# Altium project dev-board-24.PrjPcb (part 1 of 2)
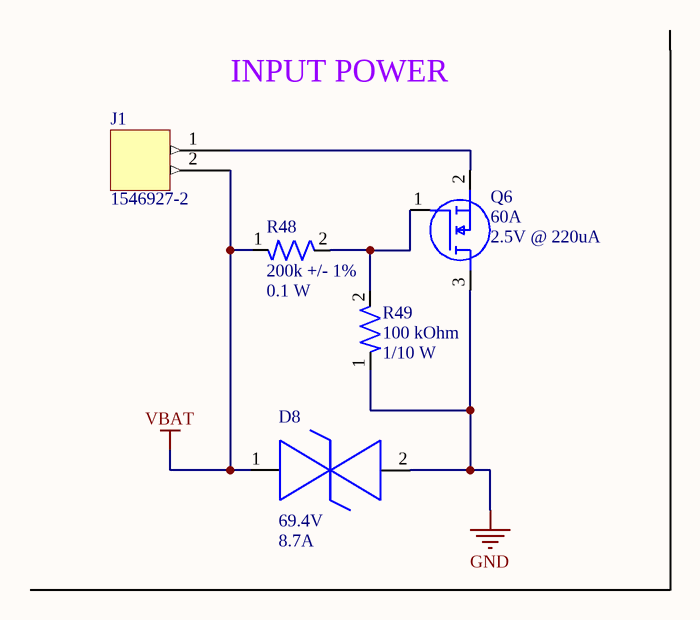
[diagram p0: Power-conn.SchDoc]
8 sheets, 260 parts. Net scope: flat (ports and power ports of the same name join across sheets).
Board file: dev-board.PcbDoc
Sheets:
  Power-conn.SchDoc
  24V-5A-buck.SchDoc
  12V-5A-buck.SchDoc
  12V-2A-buck.SchDoc
  5V-and-3V3-ldo.SchDoc
  3V3-buck.SchDoc
  5V-buck.SchDoc
  can-stm32g4.SchDoc

## Sheet Power-conn.SchDoc
size A; SheetNumber: 1; SheetTotal: 8

### Parts
D8  Vclamp: 69.4V  Peak pulser current: 8.7A  [DO-214AA (SMBJ)]  (hidden comment: SMBJE43CAH)
J1  1546927-2  [CONN-1546927-2]
Q6  Drain Current: 60A  Vgs: 2.5V @ 220uA  [NMOS-8PowerVDFN]  (hidden comment: TPH7R006PL,L1Q)
R48  Resistance: 200k +/- 1%  Power Rating: 0.1 W  [RES-0603]  (hidden comment: ERJ-3EKF2003V)
R49  Resistance: 100 kOhm  Power: 1/10 W  [RES-0603]  (hidden comment: RC0603FR-07100KL)

### Nets
GND: D8.2 Q6.3(D) R49.1
VBAT: D8.1 J1.2 R48.1
NetJ1_1: J1.1 Q6.2(S)
NetQ6_1: Q6.1(G) R48.2 R49.2

### Notes on the sheet
- INPUT POWER

### Library data of the parts
D8 = DIO-69.4V-0001: 69.4V Clamp 8.7A Ipp Tvs Diode Surface Mount DO-214AA (SMBJ); Channels: Bidirectional; Breakdown VOltage: 47.8V; Reverse working maximum voltage: 43V; Package: DO-214AA (SMBJ)
J1 = CON-2POS-0003
Q6 = NMOS-60A-0001: N-Channel 60 V 60A (Tc) 81W (Tc) Surface Mount 8-SOP Advance (5x5); Vdss: 60V; Vgs(Max): 20V; Package: 8-PowerVDFN
R48 = RES-200K-0001: 200 kOhms ±1% 0.1W, 1/10W Chip Resistor 0603 (1608 Metric) Automotive AEC-Q200 Thick Film; Manufacturer: Panasonic Electronic Components; Assembled?: Yes; MFP: ERJ-3EKF2003V; Package SIze: 0603
R49 = RES-100K-0003: 100 kOhms ±1% 0.1W, 1/10W Chip Resistor 0603 (1608 Metric) Moisture Resistant Thick Film; Tolerance: +/- 1%; Assembled?: No; Package Size: 0603

## Sheet 24V-5A-buck.SchDoc
size A4; SheetNumber: 2; SheetTotal: 8
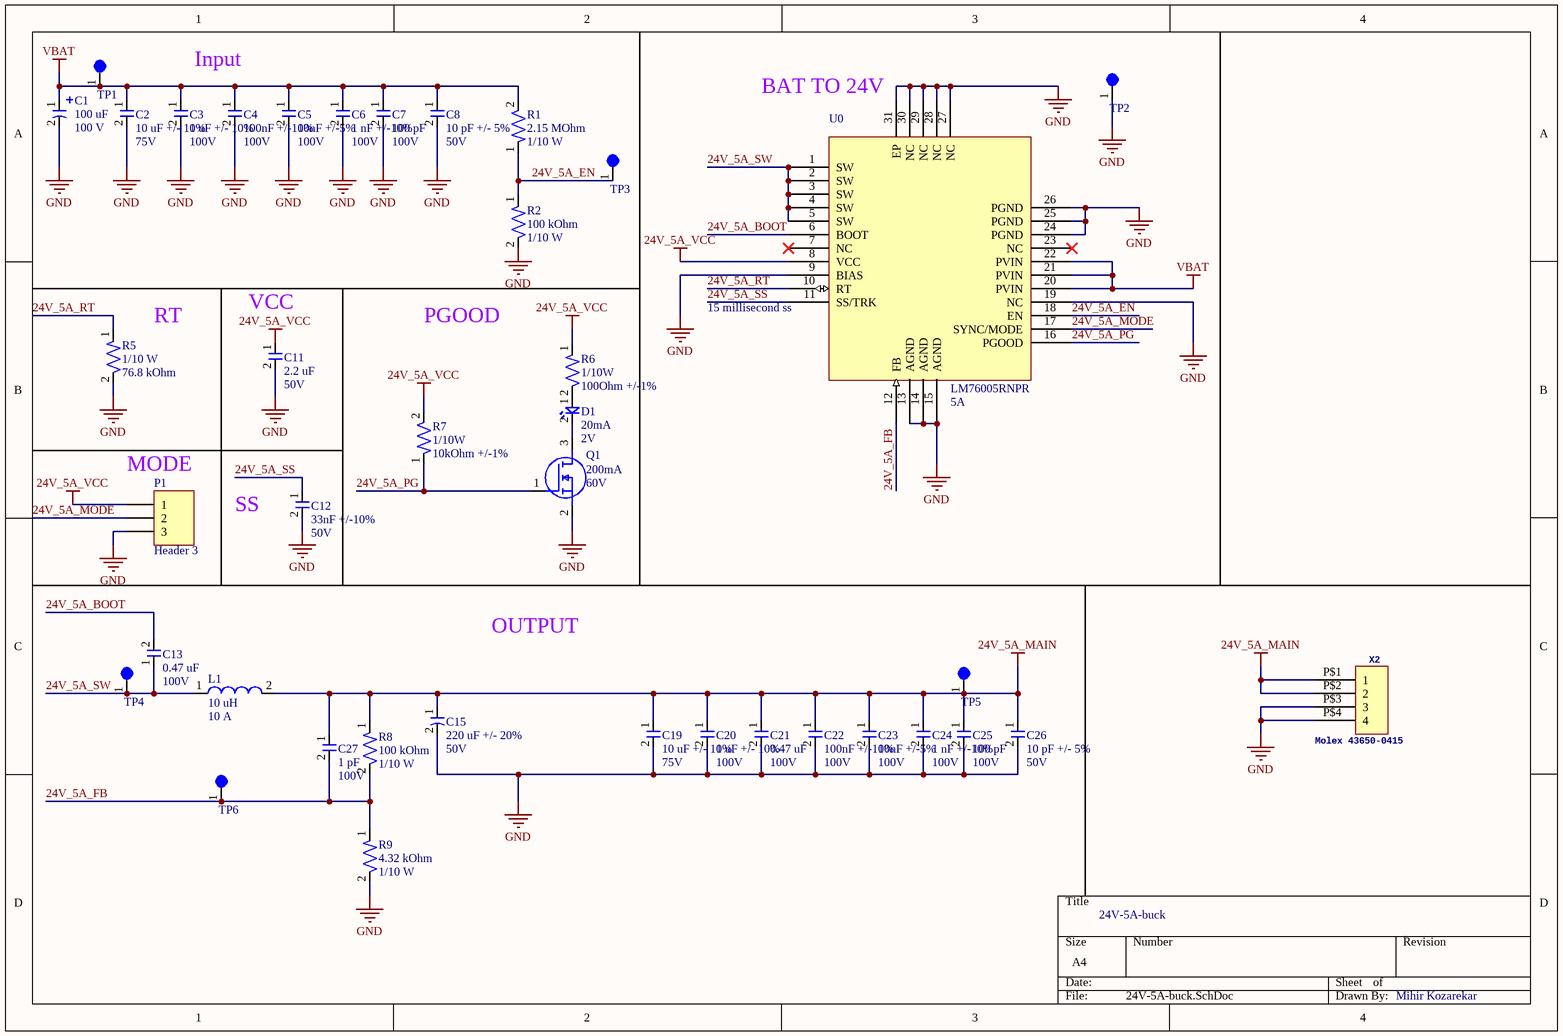
[diagram p1: 24V-5A-buck.SchDoc]

### Parts
C1  Capacitance: 100 uF  Voltage: 100 V  [ELEC-100U-0001]  (hidden comment: 100SEV100M12.5X16)
C2  Capacitance: 10 uF +/- 10%  Voltage Rating: 75V  [CAP-1210]  (hidden comment: C3225X7R1N106K250AC)
C3  Capacitance: 1 uF +/- 10%  Voltage: 100V  [CAP-1206 - duplicate]  (hidden comment: CL31B105KCHNNNE)
C4  Capacitance: 100nF +/-10%  Voltage Rating: 100V  [CAP-0603]  (hidden comment: CC0603KRX7R0BB104)
C5  Capacitance: 10nF +/-5%  Voltage Rating: 100V  [CAP-0603]  (hidden comment: C1608C0G2A103J080AC)
C6  Capacitance: 1 nF +/-10%  Voltage: 100V  [CAP-0603]  (hidden comment: C0603Y102K1RAC7867)
C7  Capacitance: 100 pF  Voltage: 100V  [CAP-0603]  (hidden comment: 0603N101J101CT)
C8  Capacitance: 10 pF +/- 5%  Voltage Rating: 50V  [CAP-0603]  (hidden comment: 0603N100J500CT)
C11  Capacitance: 2.2 uF  oltage: 50V  [CAP-0603]  (hidden comment: UMK107BBJ225KA-T)
C12  Capacitance: 33nF +/-10%  Voltage Rating: 50V  [CAP-0603]  (hidden comment: CC0603KRX7R9BB333)
C13  Capacitance: 0.47 uF  Voltage: 100V  [CAP-0805]  (hidden comment: KAM21KR72A474KL)
C15  Capacitance: 220 uF +/- 20%  Voltage Rating: 50V  [ELEC-220U-0003]  (hidden comment: 50TZV220M10X10.5)
C19  Capacitance: 10 uF +/- 10%  Voltage Rating: 75V  [CAP-1210]  (hidden comment: C3225X7R1N106K250AC)
C20  Capacitance: 1 uF +/- 10%  Voltage: 100V  [CAP-1206 - duplicate]  (hidden comment: CL31B105KCHNNNE)
C21  Capacitance: 0.47 uF  Voltage: 100V  [CAP-0805]  (hidden comment: KAM21KR72A474KL)
C22  Capacitance: 100nF +/-10%  Voltage Rating: 100V  [CAP-0603]  (hidden comment: CC0603KRX7R0BB104)
C23  Capacitance: 10nF +/-5%  Voltage Rating: 100V  [CAP-0603]  (hidden comment: C1608C0G2A103J080AC)
C24  Capacitance: 1 nF +/-10%  Voltage: 100V  [CAP-0603]  (hidden comment: C0603Y102K1RAC7867)
C25  Capacitance: 100 pF  Voltage: 100V  [CAP-0603]  (hidden comment: 0603N101J101CT)
C26  Capacitance: 10 pF +/- 5%  Voltage Rating: 50V  [CAP-0603]  (hidden comment: 0603N100J500CT)
C27  Capacitance: 1 pF  Voltage: 100V  [CAP-0603]  (hidden comment: 885012006087)
D1  Current Rating: 20mA  Vf: 2V  [LED-0603]  (hidden comment: 150060AS75000)
L1  Inductance: 10 uH  DCI: 10 A  [PWRIND-10U-0002]  (hidden comment: SRP1270-100M)
P1  Header 3  [HDR1X3]
Q1  Id-Continuous: 200mA  VDS-Max: 60V  [NMOS-SOT23-3]  (hidden comment: T2N7002AK,LM)
R1  Resistance: 2.15 MOhm  Power: 1/10 W  [RES-0603]  (hidden comment: RC0603FR-072M15L)
R2  Resistance: 100 kOhm  Power: 1/10 W  [RES-0603]  (hidden comment: RC0603FR-07100KL)
R5  Power: 1/10 W  Resistance: 76.8 kOhm  [RES-0603]  (hidden comment: RC0603FR-0776K8L)
R6  Power Rating: 1/10W  Resistance: 100Ohm +/-1%  [RES-0603]  (hidden comment: AC0603FR-10100RL)
R7  Power Rating: 1/10W  Resistance: 10kOhm +/-1%  [RES-0603]  (hidden comment: RC0603FR-0710KP)
R8  Resistance: 100 kOhm  Power: 1/10 W  [RES-0603]  (hidden comment: RC0603FR-07100KL)
R9  Resistance: 4.32 kOhm  Power: 1/10 W  [RES-0603]  (hidden comment: RC0603FR-074K32L)
TP1  5003  [TEST-POINT-0001]  (value not drawn)
TP2  5003  [TEST-POINT-0001]  (value not drawn)
TP3  5003  [TEST-POINT-0001]  (value not drawn)
TP4  5003  [TEST-POINT-0001]  (value not drawn)
TP5  5003  [TEST-POINT-0001]  (value not drawn)
TP6  5003  [TEST-POINT-0001]  (value not drawn)
U0  LM76005RNPR  Current: 5A  [IC-30-WQFN(6x4)]
X2  Molex 43650-0415  [43650-0415]

### Nets
24V_5A_MAIN: C15.1 C19.1 C20.1 C21.1 C22.1 C23.1 C24.1 C25.1 C26.1 C27.1 L1.2 R8.1 TP5.1 X2.P$1(1) X2.P$2(2)
24V_5A_VCC: C11.1 P1.1 R6.1 R7.2 U0.8(VCC)
GND: C1.2 C2.2 C3.2 C4.2 C5.2 C6.2 C7.2 C8.2 C11.2 C12.2 C15.2 C19.2 C20.2 C21.2 C22.2 C23.2 C24.2 C25.2 C26.2 P1.3 Q1.2(S) R2.2 R5.2 R9.2 TP2.1 U0.9(BIAS) U0.13(AGND) U0.14(AGND) U0.15(AGND) U0.19(NC) U0.24(PGND) U0.25(PGND) U0.26(PGND) U0.27(NC) U0.28(NC) U0.29(NC) U0.30(NC) U0.31(EP) X2.P$3(3) X2.P$4(4)
VBAT: C1.1 C2.1 C3.1 C4.1 C5.1 C6.1 C7.1 C8.1 R1.2 TP1.1 U0.20(PVIN) U0.21(PVIN) U0.22(PVIN)
24V_5A_BOOT: C13.2 U0.6(BOOT)
24V_5A_EN: R1.1 R2.1 TP3.1 U0.18(EN)
24V_5A_FB: C27.2 R8.2 R9.1 TP6.1 U0.12(FB)
24V_5A_MODE: P1.2 U0.17(SYNC/MODE)
24V_5A_PG: Q1.1(G) R7.1 U0.16(PGOOD)
24V_5A_RT: R5.1 U0.10(RT)
24V_5A_SS: C12.1 U0.11(SS/TRK)
24V_5A_SW: C13.1 L1.1 TP4.1 U0.1(SW) U0.2(SW) U0.3(SW) U0.4(SW) U0.5(SW)
NetD1_1: D1.1 R6.2
NetD1_2: D1.2 Q1.3(D)

Not connected (* = marked no-connect by the designer): U0 7(NC)* 23(NC)*

### Notes on the sheet
- Input
- (near U0) BAT TO 24V
- (near C11) VCC
- (near U0) 15 millisecond ss
- (near R5) RT
- PGOOD
- (near P1) MODE
- (near C12) SS
- OUTPUT
- 24V-5A-buck
- Mihir Kozarekar

### Library data of the parts
C1 = ELEC-100U-0001: 100 µF 100 V Aluminum Electrolytic Capacitors Radial, Can - SMD 2000 Hrs @ 85°C; Manufacturer: Rubycon; Tolerance: +/- 20%; Assembled?: No; ESR: idk check the datasheet i couldnt find it
C2 C19 = CAP-10U-0004: 10 µF ±10% 75V Ceramic Capacitor X7R 1210 (3225 Metric)
C3 C20 = CAP-1U-0001: 1 µF ±10% 100V Ceramic Capacitor X7R 1206 (3216 Metric)
C4 C22 = CAP-100N-0001: CAP CER 0.1UF 100V X7R 0603; Manufacturer: YAGEO; Assembled?: no; Manufacturer Part Number: CC0603KRX7R0BB104; Temperature Coefficient: X7R; Package Size: 0603
C5 C23 = CAP-10N-0002: CAP CER 10000PF 100V C0G 0603; Manufacturer: TDK Corporation; Temperature Coefficient: C0G/NP0; Assembled?: no; Manufacturer Part Number: C1608C0G2A103J080AC; Package Size: 0603
C6 C24 = CAP-1N-0001: 1000 pF ±10% 100V Ceramic Capacitor X7R 0603 (1608 Metric)
C7 C25 = CAP-100P-0002: 100 pF ±5% 100V Ceramic Capacitor C0G, NP0 0603 (1608 Metric); Tolerance: +/-5%; Temp Coeff: C0G/NP0; Package Size: 0603
C8 C26 = CAP-10P-0001: 10 pF ±5% 50V Ceramic Capacitor C0G, NP0 0603 (1608 Metric); Manufacturer: Walshin Technology Corporation; Assembled?: Yes; Manufacturer Part Number: 0603N100J500CT; Temperature Coefficient: C0G, NP0; Package Size: 0603
C11 = CAP-2.2U-0001: 2.2 µF ±10% 50V Ceramic Capacitor X5R 0603 (1608 Metric)
C12 = CAP-33N-0001: 0.033 µF ±10% 50V Ceramic Capacitor X7R 0603 (1608 Metric); Manufacturer: YAGEO; Assembled?: no; Manufacturer Part Number: CC0603KRX7R9BB333; Temperature Coefficient: X7R; Package Size: 0603
C13 C21 = CAP-0.47U-0001: 0.47 µF ±10% 100V Ceramic Capacitor X7R 0805 (2012 Metric); Tolerance: +/- 10%; Assembled?: No; Temperature Coefficient: X7R; Package Size: 0805
C15 = ELEC-220U-0003: 220 µF 50 V Aluminum Electrolytic Capacitors Radial, Can - SMD 2000 Hrs @ 105°C; Size: .406inx.406in*.413in
C27 = CAP-1P-0001: 1 pF ±0.25pF 100V Ceramic Capacitor C0G, NP0 0603 (1608 Metric); Tolerance: +/- 0.25 pF; Temperature Coefficient: C0G/NP0; Assembled?: No; Package Size: 0603
D1 = LED_Amber_0001: CAP CER 0.1UF 100V X7R 0603; Manufacturer: Wurth Electronik; Assembled?: no; Color: Amber; Manufacturer Part Number: 150060AS75000; Package Size: 0603
L1 = PWRIND-10U-0002: 10 µH Shielded Drum Core, Wirewound Inductor 10 A 16.8mOhm Max Nonstandard; Tolerance: +/- 20%; Isat: 16A; Assembled?: No; DCR: 16.8 mOhm
P1 = Header 3: Header, 3-Pin; LatestRevisionDate: 17-Jul-2002; LatestRevisionNote: Re-released for DXP Platform.; Publisher: Altium Limited
Q1 = NMOS-200MA-0001: MOSFET N-CH 60V 200MA SOT23; Manufacturer: Toshiba; FET type: N-Channel; Rds On-Max: 3.9Ohm; Vgs-Max: 20V; Assembled?: no; Manufacturer Part Number: T2N7002AK,LM; Package: SOT-23-3
R1 = RES-2.15M-0001: 2.15 MOhms ±1% 0.1W, 1/10W Chip Resistor 0603 (1608 Metric) Moisture Resistant Thick Film; Tolerance: +/-1%; Assembled?: No; Package Size: 0603
R2 R8 = RES-100K-0003: as R49 on sheet Power-conn; Package Size: 0603
R5 = RES-76.8K-0001: 76.8 kOhms ±1% 0.1W, 1/10W Chip Resistor 0603 (1608 Metric) Moisture Resistant Thick Film; Manufacturer: Yageo; Tolerance: +/- 1%; Package Size: 0603
R6 = RES-100-0002: 100 Ohms ±1% 0.1W, 1/10W Chip Resistor 0603 (1608 Metric) Automotive AEC-Q200 Thick Film; Manufacturer: YAGEO; Assembled?: no; Manufacturer Part Number: AC0603FR-10100RL; Package Size: 0603
R7 = RES-10K-0002: RES SMD 10K OHM 1% 1/10W 0603; Manufacturer: YAGEO; Assembled?: no; Manufacturer Part Number: RC0603FR-0710KP; Package Size: 0603
R9 = RES-4.32K-0001: 4.32 kOhms ±1% 0.1W, 1/10W Chip Resistor 0603 (1608 Metric) Moisture Resistant Thick Film; Tolerance: +/-1%; Assembled?: No; Package Size: 0603
TP1-TP6 = TEST-POINT-0001: Oranange PC Test Point, Miniature Phoisphor Bronze Silver Plating Through Hole Mounting Type
U0 = IC-BUCK-0006: Buck Switching Regulator IC Positive Adjustable 1V 1 Output 5A 30-WFQFN Exposed Pad; Manufacturer: Texas Instruments; Assembled?: no; Manufacturer Part Number: LM76005RNPR; Type: Buck; Package: 30-WFQFN
X2 = Micro-Fit Molex 4 Pin Vertical: GateName_1: G$1; SymbolName_1: HEADER_POS4; DeviceSetName: HEADER_POS4_?; DeviceName: 43650-0415; LibraryName: con-molex-micro-fit-3_0_2; Package: 43650-0415

## Sheet 12V-5A-buck.SchDoc
size A4; SheetNumber: 3; SheetTotal: 8
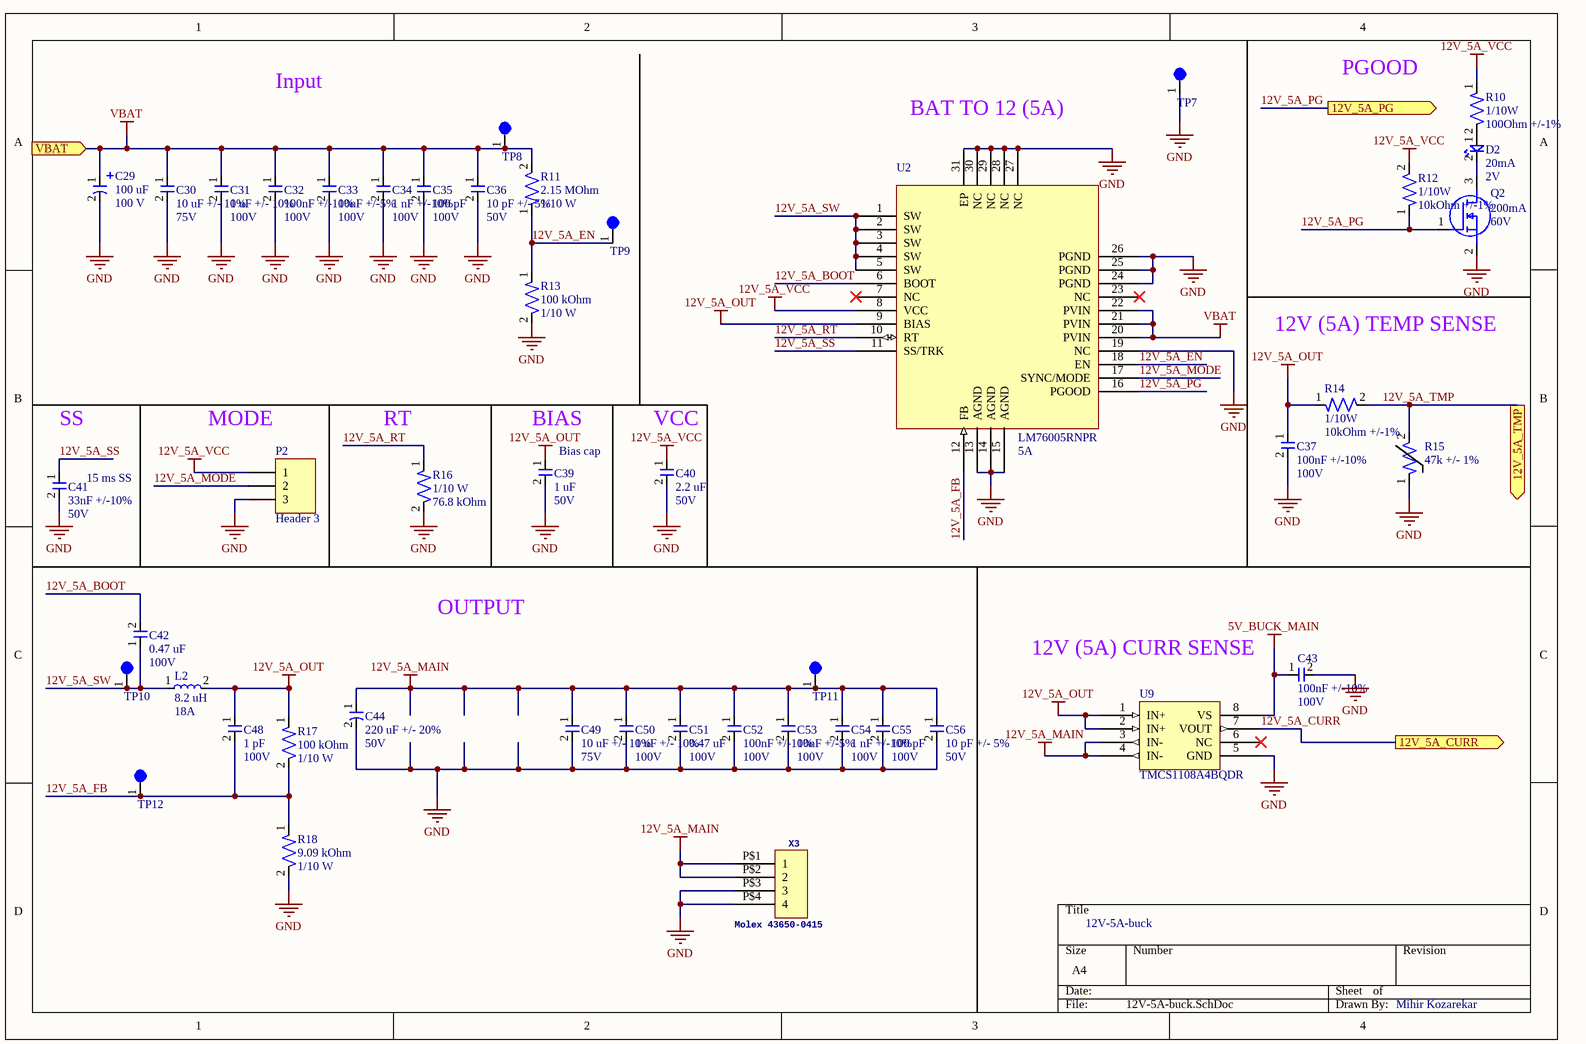
[diagram p2: 12V-5A-buck.SchDoc]

### Parts
C29  Capacitance: 100 uF  Voltage: 100 V  [ELEC-100U-0001]  (hidden comment: 100SEV100M12.5X16)
C30  Capacitance: 10 uF +/- 10%  Voltage Rating: 75V  [CAP-1210]  (hidden comment: C3225X7R1N106K250AC)
C31  Capacitance: 1 uF +/- 10%  Voltage: 100V  [CAP-1206 - duplicate]  (hidden comment: CL31B105KCHNNNE)
C32  Capacitance: 100nF +/-10%  Voltage Rating: 100V  [CAP-0603]  (hidden comment: CC0603KRX7R0BB104)
C33  Capacitance: 10nF +/-5%  Voltage Rating: 100V  [CAP-0603]  (hidden comment: C1608C0G2A103J080AC)
C34  Capacitance: 1 nF +/-10%  Voltage: 100V  [CAP-0603]  (hidden comment: C0603Y102K1RAC7867)
C35  Capacitance: 100 pF  Voltage: 100V  [CAP-0603]  (hidden comment: 0603N101J101CT)
C36  Capacitance: 10 pF +/- 5%  Voltage Rating: 50V  [CAP-0603]  (hidden comment: 0603N100J500CT)
C37  Capacitance: 100nF +/-10%  Voltage Rating: 100V  [CAP-0603]  (hidden comment: CC0603KRX7R0BB104)
C39  Capacitance: 1 uF  Voltage: 50V  [CAP-0603]  (hidden comment: UMK107AB7105KA-T)
C40  Capacitance: 2.2 uF  oltage: 50V  [CAP-0603]  (hidden comment: UMK107BBJ225KA-T)
C41  Capacitance: 33nF +/-10%  Voltage Rating: 50V  [CAP-0603]  (hidden comment: CC0603KRX7R9BB333)
C42  Capacitance: 0.47 uF  Voltage: 100V  [CAP-0805]  (hidden comment: KAM21KR72A474KL)
C43  Capacitance: 100nF +/-10%  Voltage Rating: 100V  [CAP-0603]  (hidden comment: CC0603KRX7R0BB104)
C44  Capacitance: 220 uF +/- 20%  Voltage Rating: 50V  [ELEC-220U-0003]  (hidden comment: 50TZV220M10X10.5)
C48  Capacitance: 1 pF  Voltage: 100V  [CAP-0603]  (hidden comment: 885012006087)
C49  Capacitance: 10 uF +/- 10%  Voltage Rating: 75V  [CAP-1210]  (hidden comment: C3225X7R1N106K250AC)
C50  Capacitance: 1 uF +/- 10%  Voltage: 100V  [CAP-1206 - duplicate]  (hidden comment: CL31B105KCHNNNE)
C51  Capacitance: 0.47 uF  Voltage: 100V  [CAP-0805]  (hidden comment: KAM21KR72A474KL)
C52  Capacitance: 100nF +/-10%  Voltage Rating: 100V  [CAP-0603]  (hidden comment: CC0603KRX7R0BB104)
C53  Capacitance: 10nF +/-5%  Voltage Rating: 100V  [CAP-0603]  (hidden comment: C1608C0G2A103J080AC)
C54  Capacitance: 1 nF +/-10%  Voltage: 100V  [CAP-0603]  (hidden comment: C0603Y102K1RAC7867)
C55  Capacitance: 100 pF  Voltage: 100V  [CAP-0603]  (hidden comment: 0603N101J101CT)
C56  Capacitance: 10 pF +/- 5%  Voltage Rating: 50V  [CAP-0603]  (hidden comment: 0603N100J500CT)
D2  Current Rating: 20mA  Vf: 2V  [LED-0603]  (hidden comment: 150060AS75000)
L2  Inductance: 8.2 uH  DCI: 18A  [PWRIND-8.2U-0002]  (hidden comment: IHLP6767GZER8R2M01)
P2  Header 3  [HDR1X3]
Q2  Id-Continuous: 200mA  VDS-Max: 60V  [NMOS-SOT23-3]  (hidden comment: T2N7002AK,LM)
R10  Power Rating: 1/10W  Resistance: 100Ohm +/-1%  [RES-0603]  (hidden comment: AC0603FR-10100RL)
R11  Resistance: 2.15 MOhm  Power: 1/10 W  [RES-0603]  (hidden comment: RC0603FR-072M15L)
R12  Power Rating: 1/10W  Resistance: 10kOhm +/-1%  [RES-0603]  (hidden comment: RC0603FR-0710KP)
R13  Resistance: 100 kOhm  Power: 1/10 W  [RES-0603]  (hidden comment: RC0603FR-07100KL)
R14  Power Rating: 1/10W  Resistance: 10kOhm +/-1%  [RES-0603]  (hidden comment: RC0603FR-0710KP)
R15  Resistance: 47k +/- 1%  [RES-0402]  (hidden comment: TMP6431DECR)
R16  Power: 1/10 W  Resistance: 76.8 kOhm  [RES-0603]  (hidden comment: RC0603FR-0776K8L)
R17  Resistance: 100 kOhm  Power: 1/10 W  [RES-0603]  (hidden comment: RC0603FR-07100KL)
R18  Resistance: 9.09 kOhm  Power: 1/10 W  [RES-0603]  (hidden comment: RC0603FR-079K09L)
TP7  5003  [TEST-POINT-0001]  (value not drawn)
TP8  5003  [TEST-POINT-0001]  (value not drawn)
TP9  5003  [TEST-POINT-0001]  (value not drawn)
TP10  5003  [TEST-POINT-0001]  (value not drawn)
TP11  5003  [TEST-POINT-0001]  (value not drawn)
TP12  5003  [TEST-POINT-0001]  (value not drawn)
U2  LM76005RNPR  Current: 5A  [IC-30-WQFN(6x4)]
U9  TMCS1108A4BQDR  [IC-CURRENT-0001]
X3  Molex 43650-0415  [43650-0415]

### Ports
12V_5A_CURR (out), 12V_5A_PG (out), 12V_5A_TMP (out), VBAT (in)

### Nets
5V_BUCK_MAIN: C43.1 U9.8(VS)
12V_5A_MAIN: C44.1 C49.1 C50.1 C51.1 C52.1 C53.1 C54.1 C55.1 C56.1 TP11.1 U9.3(IN-) U9.4(IN-) X3.P$1(1) X3.P$2(2)
12V_5A_OUT: C37.1 C39.1 C48.1 L2.2 R14.1 R17.1 U2.9(BIAS) U9.1(IN+) U9.2(IN+)
12V_5A_VCC: C40.1 P2.1 R10.1 R12.2 U2.8(VCC)
GND: C29.2 C30.2 C31.2 C32.2 C33.2 C34.2 C35.2 C36.2 C37.2 C39.2 C40.2 C41.2 C43.2 C44.2 C49.2 C50.2 C51.2 C52.2 C53.2 C54.2 C55.2 C56.2 P2.3 Q2.2(S) R13.2 R15.1 R16.2 R18.2 TP7.1 U2.13(AGND) U2.14(AGND) U2.15(AGND) U2.19(NC) U2.24(PGND) U2.25(PGND) U2.26(PGND) U2.27(NC) U2.28(NC) U2.29(NC) U2.30(NC) U2.31(EP) U9.5(GND) X3.P$3(3) X3.P$4(4)
VBAT: C29.1 C30.1 C31.1 C32.1 C33.1 C34.1 C35.1 C36.1 R11.2 TP8.1 U2.20(PVIN) U2.21(PVIN) U2.22(PVIN) ; port VBAT
12V_5A_BOOT: C42.2 U2.6(BOOT)
12V_5A_CURR: U9.7(VOUT) ; port 12V_5A_CURR
12V_5A_EN: R11.1 R13.1 TP9.1 U2.18(EN)
12V_5A_FB: C48.2 R17.2 R18.1 TP12.1 U2.12(FB)
12V_5A_MODE: P2.2 U2.17(SYNC/MODE)
12V_5A_PG: Q2.1(G) R12.1 U2.16(PGOOD) ; port 12V_5A_PG
12V_5A_RT: R16.1 U2.10(RT)
12V_5A_SS: C41.1 U2.11(SS/TRK)
12V_5A_SW: C42.1 L2.1 TP10.1 U2.1(SW) U2.2(SW) U2.3(SW) U2.4(SW) U2.5(SW)
12V_5A_TMP: R14.2 R15.2 ; port 12V_5A_TMP
NetD2_1: D2.1 R10.2
NetD2_2: D2.2 Q2.3(D)

Not connected (* = marked no-connect by the designer): U2 7(NC)* 23(NC)*; U9 6(NC)*

### Notes on the sheet
- Input
- BAT TO 12 (5A)
- PGOOD
- 12V (5A) TEMP SENSE
- (near C41) SS
- (near P2) MODE
- (near R16) RT
- (near C39) BIAS
- (near C39) Bias cap
- (near C40) VCC
- (near C41) 15 ms SS
- OUTPUT
- 12V (5A) CURR SENSE
- 12V-5A-buck
- Mihir Kozarekar

### Library data of the parts
C29 = ELEC-100U-0001: as C1 on sheet 24V-5A-buck
C30 C49 = CAP-10U-0004: as C2 on sheet 24V-5A-buck
C31 C50 = CAP-1U-0001: as C3 on sheet 24V-5A-buck
C32 C37 C43 C52 = CAP-100N-0001: as C4 on sheet 24V-5A-buck; Manufacturer Part Number: CC0603KRX7R0BB104; Temperature Coefficient: X7R; Package Size: 0603
C33 C53 = CAP-10N-0002: as C5 on sheet 24V-5A-buck; Manufacturer Part Number: C1608C0G2A103J080AC; Package Size: 0603
C34 C54 = CAP-1N-0001: as C6 on sheet 24V-5A-buck
C35 C55 = CAP-100P-0002: as C7 on sheet 24V-5A-buck; Package Size: 0603
C36 C56 = CAP-10P-0001: as C8 on sheet 24V-5A-buck; Manufacturer Part Number: 0603N100J500CT; Temperature Coefficient: C0G, NP0; Package Size: 0603
C39 = CAP-1U-0002: 1 µF ±10% 50V Ceramic Capacitor X7R 0603 (1608 Metric); Package Size: 0603
C40 = CAP-2.2U-0001: as C11 on sheet 24V-5A-buck
C41 = CAP-33N-0001: as C12 on sheet 24V-5A-buck; Manufacturer Part Number: CC0603KRX7R9BB333; Temperature Coefficient: X7R; Package Size: 0603
C42 C51 = CAP-0.47U-0001: as C13 on sheet 24V-5A-buck; Temperature Coefficient: X7R; Package Size: 0805
C44 = ELEC-220U-0003: as C15 on sheet 24V-5A-buck; Size: .406inx.406in*.413in
C48 = CAP-1P-0001: as C27 on sheet 24V-5A-buck; Package Size: 0603
D2 = LED_Amber_0001: as D1 on sheet 24V-5A-buck; Manufacturer Part Number: 150060AS75000; Package Size: 0603
L2 = PWRIND-8.2U-0002: 8.2 µH Shielded Molded Inductor 18 A 10.66mOhm Max Nonstandard; Isat: 25A; Tolerance: +/-20%; DCR: 10.66 mOhm
P2 = Header 3: Header, 3-Pin; LatestRevisionDate: 17-Jul-2002; LatestRevisionNote: Re-released for DXP Platform.; Publisher: Altium Limited
Q2 = NMOS-200MA-0001: as Q1 on sheet 24V-5A-buck; Manufacturer Part Number: T2N7002AK,LM; Package: SOT-23-3
R10 = RES-100-0002: as R6 on sheet 24V-5A-buck; Manufacturer Part Number: AC0603FR-10100RL; Package Size: 0603
R11 = RES-2.15M-0001: as R1 on sheet 24V-5A-buck; Package Size: 0603
R12 R14 = RES-10K-0002: as R7 on sheet 24V-5A-buck; Manufacturer Part Number: RC0603FR-0710KP; Package Size: 0603
R13 R17 = RES-100K-0003: as R49 on sheet Power-conn; Package Size: 0603
R15 = THERM-47K-0001: PTC Thermistor 47 kOhms 0402 (1006 Metric); Manufacturer: Texas Instruments; Manufacturer Part Number: TMP6431DECR; Package Size: 0402
R16 = RES-76.8K-0001: as R5 on sheet 24V-5A-buck; Package Size: 0603
R18 = RES-9.09K-0001: 9.09 kOhms ±1% 0.1W, 1/10W Chip Resistor 0603 (1608 Metric) Moisture Resistant Thick Film; Tolerance: +/-1%; Assembled?: No; Package Size: 0603
TP7-TP12 = TEST-POINT-0001: as TP1 on sheet 24V-5A-buck
U2 = IC-BUCK-0006: as U0 on sheet 24V-5A-buck; Manufacturer Part Number: LM76005RNPR; Type: Buck; Package: 30-WFQFN
U9 = IC-CURRENT-0004: Current Sensor 1 Channel Hall Effect Bidirectional 8-SOIC (0.154", 3.90mm Width); Assembled?: No; Supply Voltage: 5V; Footprint: 8-SOIC
X3 = Micro-Fit Molex 4 Pin Vertical: as X2 on sheet 24V-5A-buck; DeviceName: 43650-0415; LibraryName: con-molex-micro-fit-3_0_2; Package: 43650-0415

## Sheet 12V-2A-buck.SchDoc
size A4; SheetNumber: 4; SheetTotal: 8
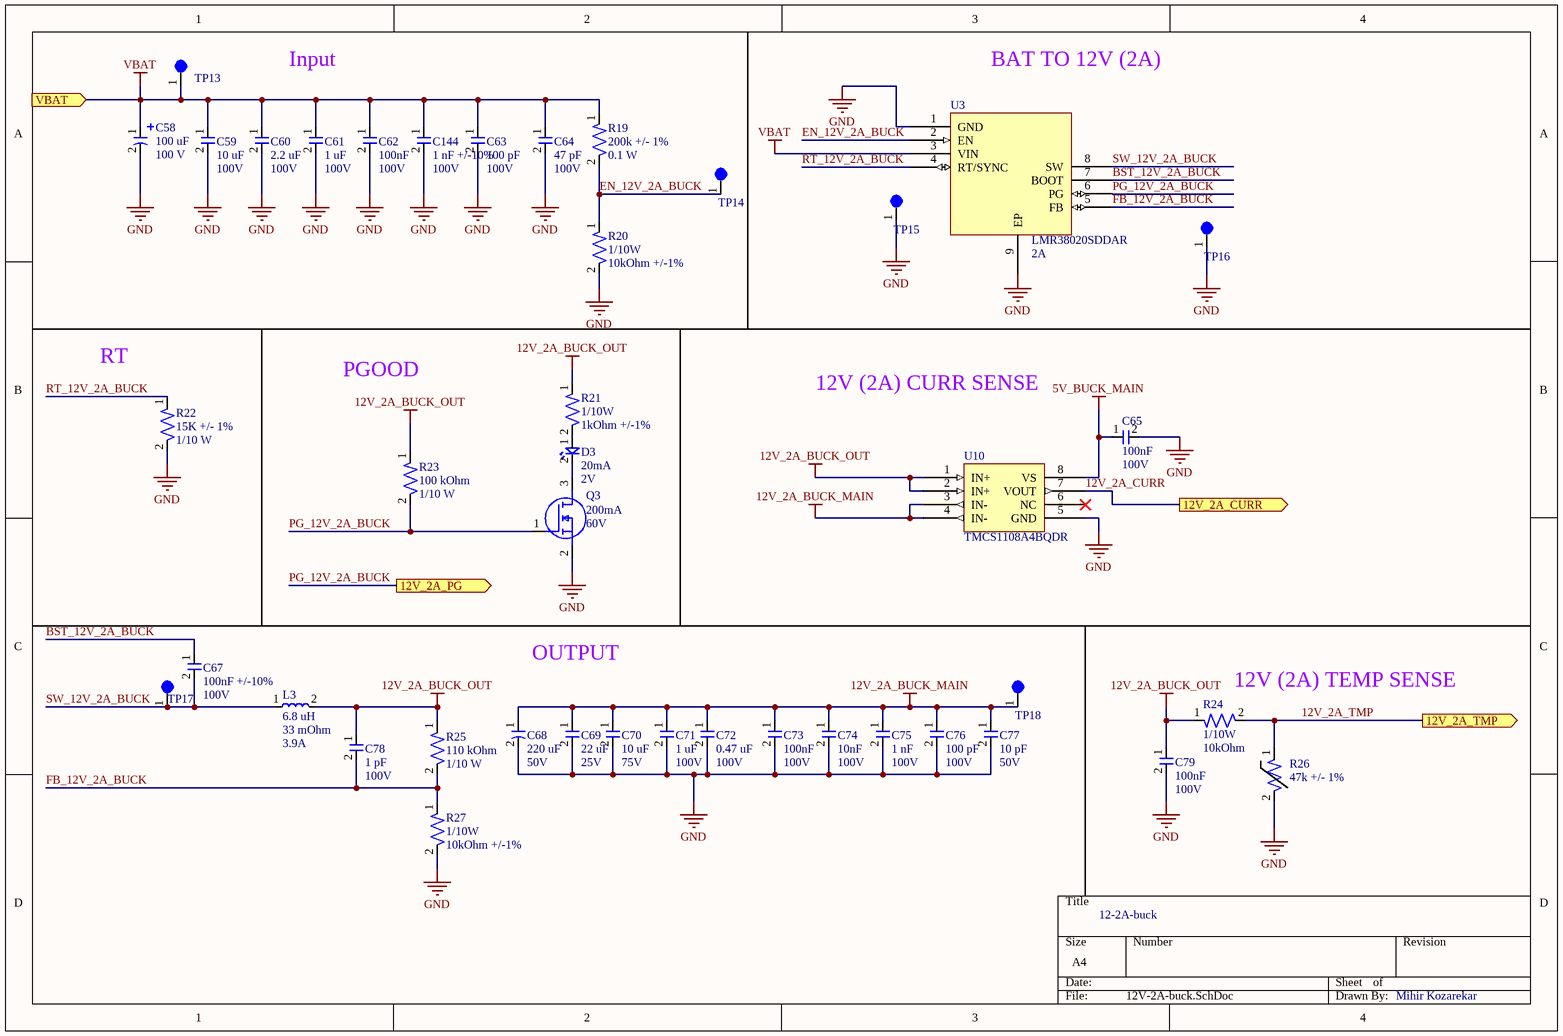
[diagram p3: 12V-2A-buck.SchDoc]

### Parts
C58  Capacitance: 100 uF  Voltage: 100 V  [ELEC-100U-0001]  (hidden comment: 100SEV100M12.5X16)
C59  Capcitance: 10 uF  Voltage Rating: 100V  [CAP-1210]  (hidden comment: GRM32EC72A106KE05L)
C60  Capacitance: 2.2 uF  Voltage: 100V  [CAP-1206]  (hidden comment: CL31B225KCHSNNE)
C61  Capacitance: 1 uF  Voltage: 100V  [CAP-1206 - duplicate]  (hidden comment: CL31B105KCHNNNE)
C62  Capacitance: 100nF  Voltage Rating: 100V  [CAP-0603]  (hidden comment: CC0603KRX7R0BB104)
C63  Capacitance: 100 pF  Voltage: 100V  [CAP-0603]  (hidden comment: 0603N101J101CT)
C64  Capacitance: 47 pF  Voltage Rating: 100V  [CAP-0603]  (hidden comment: 7447798111)
C65  Capacitance: 100nF  Voltage Rating: 100V  [CAP-0603]  (hidden comment: CC0603KRX7R0BB104)
C67  Capacitance: 100nF +/-10%  Voltage Rating: 100V  [CAP-0603]  (hidden comment: CC0603KRX7R0BB104)
C68  Capacitance: 220 uF  Voltage Rating: 50V  [ELEC-220U-0003]  (hidden comment: 50TZV220M10X10.5)
C69  Capacitance: 22 uF  Voltage: 25V  [CAP-1210]  (hidden comment: CL32B226KAJNNNE)
C70  Capacitance: 10 uF  Voltage Rating: 75V  [CAP-1210]  (hidden comment: C3225X7R1N106K250AC)
C71  Capacitance: 1 uF  Voltage: 100V  [CAP-1206 - duplicate]  (hidden comment: CL31B105KCHNNNE)
C72  Capacitance: 0.47 uF  Voltage: 100V  [CAP-0805]  (hidden comment: KAM21KR72A474KL)
C73  Capacitance: 100nF  Voltage Rating: 100V  [CAP-0603]  (hidden comment: CC0603KRX7R0BB104)
C74  Capacitance: 10nF  Voltage Rating: 100V  [CAP-0603]  (hidden comment: C1608C0G2A103J080AC)
C75  Capacitance: 1 nF  Voltage: 100V  [CAP-0603]  (hidden comment: C0603Y102K1RAC7867)
C76  Capacitance: 100 pF  Voltage: 100V  [CAP-0603]  (hidden comment: 0603N101J101CT)
C77  Capacitance: 10 pF  Voltage Rating: 50V  [CAP-0603]  (hidden comment: 0603N100J500CT)
C78  Capacitance: 1 pF  Voltage: 100V  [CAP-0603]  (hidden comment: 885012006087)
C79  Capacitance: 100nF  Voltage Rating: 100V  [CAP-0603]  (hidden comment: CC0603KRX7R0BB104)
C144  Capacitance: 1 nF +/-10%  Voltage: 100V  [CAP-0603]  (hidden comment: C0603Y102K1RAC7867)
D3  Current Rating: 20mA  Vf: 2V  [LED-0603]  (hidden comment: 150060AS75000)
L3  Inductance: 6.8 uH  DCR: 33 mOhm  DCI: 3.9A  [PWRIND-6.8U-0001]  (hidden comment: SRN8040-6R8Y)
Q3  Id-Continuous: 200mA  VDS-Max: 60V  [NMOS-SOT23-3]  (hidden comment: T2N7002AK,LM)
R19  Resistance: 200k +/- 1%  Power Rating: 0.1 W  [RES-0603]  (hidden comment: ERJ-3EKF2003V)
R20  Power Rating: 1/10W  Resistance: 10kOhm +/-1%  [RES-0603]  (hidden comment: RC0603FR-0710KP)
R21  Power Rating: 1/10W  Resistance: 1kOhm +/-1%  [RES-0603]  (hidden comment: RT0603FRE131KL)
R22  Res: 15K +/- 1%  Power: 1/10 W  [RES-0402]  (hidden comment: ERJ-2RKF1502X)
R23  Resistance: 100 kOhm  Power: 1/10 W  [RES-0603]  (hidden comment: RC0603FR-07100KL)
R24  Power Rating: 1/10W  Resistance: 10kOhm  [RES-0603]  (hidden comment: RC0603FR-0710KP)
R25  Resistance: 110 kOhm  Power: 1/10 W  [RES-0603]  (hidden comment: RC0603FR-07110KL)
R26  Resistance: 47k +/- 1%  [RES-0402]  (hidden comment: TMP6431DECR)
R27  Power Rating: 1/10W  Resistance: 10kOhm +/-1%  [RES-0603]  (hidden comment: RC0603FR-0710KP)
TP13  5003  [TEST-POINT-0001]  (value not drawn)
TP14  5003  [TEST-POINT-0001]  (value not drawn)
TP15  5003  [TEST-POINT-0001]  (value not drawn)
TP16  5003  [TEST-POINT-0001]  (value not drawn)
TP17  5003  [TEST-POINT-0001]  (value not drawn)
TP18  5003  [TEST-POINT-0001]  (value not drawn)
U3  LMR38020SDDAR  Current: 2A  [IC-8PowerSOIC]
U10  TMCS1108A4BQDR  [IC-CURRENT-0001]

### Ports
12V_2A_CURR (out), 12V_2A_PG (out), 12V_2A_TMP (out), VBAT (in)

### Nets
5V_BUCK_MAIN: C65.1 U10.8(VS)
12V_2A_BUCK_MAIN: C68.1 C69.1 C70.1 C71.1 C72.1 C73.1 C74.1 C75.1 C76.1 C77.1 TP18.1 U10.3(IN-) U10.4(IN-)
12V_2A_BUCK_OUT: C78.1 C79.1 L3.2 R21.1 R23.1 R24.1 R25.1 U10.1(IN+) U10.2(IN+)
GND: C58.2 C59.2 C60.2 C61.2 C62.2 C63.2 C64.2 C65.2 C68.2 C69.2 C70.2 C71.2 C72.2 C73.2 C74.2 C75.2 C76.2 C77.2 C79.2 C144.2 Q3.2(S) R20.2 R22.2 R26.2 R27.2 TP15.1 TP16.1 U3.1(GND) U3.9(EP) U10.5(GND)
VBAT: C58.1 C59.1 C60.1 C61.1 C62.1 C63.1 C64.1 C144.1 R19.1 TP13.1 U3.3(VIN) ; port VBAT
12V_2A_CURR: U10.7(VOUT) ; port 12V_2A_CURR
12V_2A_TMP: R24.2 R26.1 ; port 12V_2A_TMP
BST_12V_2A_BUCK: C67.1 U3.7(BOOT)
EN_12V_2A_BUCK: R19.2 R20.1 TP14.1 U3.2(EN)
FB_12V_2A_BUCK: C78.2 R25.2 R27.1 U3.5(FB)
PG_12V_2A_BUCK: Q3.1(G) R23.2 U3.6(PG) ; port 12V_2A_PG
RT_12V_2A_BUCK: R22.1 U3.4(RT/SYNC)
SW_12V_2A_BUCK: C67.2 L3.1 TP17.1 U3.8(SW)
NetD3_1: D3.1 R21.2
NetD3_2: D3.2 Q3.3(D)

Not connected (* = marked no-connect by the designer): U10 6(NC)*

### Notes on the sheet
- Input
- BAT TO 12V (2A)
- RT
- PGOOD
- 12V (2A) CURR SENSE
- OUTPUT
- (near R24) 12V (2A) TEMP SENSE
- 12-2A-buck
- Mihir Kozarekar

### Library data of the parts
C58 = ELEC-100U-0001: as C1 on sheet 24V-5A-buck
C59 = CAP-10U-0003: 10 µF ±10% 100V Ceramic Capacitor X7S 1210 (3225 Metric); Package Size: 1210
C60 = CAP-2.2U-0003: 2.2 µF ±10% 100V Ceramic Capacitor X7R 1206 (3216 Metric); Manufacturer: Samsung Electro-Mechanics; Tolerance: +/- 10%; Assembled?: No; Manufacturer Part Number: CL31B225KCHSNNE; Temperature Coefficient: X7R; Package Size: 1206
C61 C71 = CAP-1U-0001: as C3 on sheet 24V-5A-buck
C62 C65 C67 C73 C79 = CAP-100N-0001: as C4 on sheet 24V-5A-buck; Manufacturer Part Number: CC0603KRX7R0BB104; Temperature Coefficient: X7R; Package Size: 0603
C63 C76 = CAP-100P-0002: as C7 on sheet 24V-5A-buck; Package Size: 0603
C64 = CAP-47P-0001: 47 pF ±5% 100V Ceramic Capacitor C0G, NP0 0603 (1608 Metric)
C68 = ELEC-220U-0003: as C15 on sheet 24V-5A-buck; Size: .406inx.406in*.413in
C69 = CAP-22U-0003: 22 µF ±10% 25V Ceramic Capacitor X7R 1210 (3225 Metric); Tolerance: +/- 10%; Assembled?: No; Temperature Coefficient: X7R; Package Size: 1210
C70 = CAP-10U-0004: as C2 on sheet 24V-5A-buck
C72 = CAP-0.47U-0001: as C13 on sheet 24V-5A-buck; Temperature Coefficient: X7R; Package Size: 0805
C74 = CAP-10N-0002: as C5 on sheet 24V-5A-buck; Manufacturer Part Number: C1608C0G2A103J080AC; Package Size: 0603
C75 C144 = CAP-1N-0001: as C6 on sheet 24V-5A-buck
C77 = CAP-10P-0001: as C8 on sheet 24V-5A-buck; Manufacturer Part Number: 0603N100J500CT; Temperature Coefficient: C0G, NP0; Package Size: 0603
C78 = CAP-1P-0001: as C27 on sheet 24V-5A-buck; Package Size: 0603
D3 = LED_Amber_0001: as D1 on sheet 24V-5A-buck; Manufacturer Part Number: 150060AS75000; Package Size: 0603
L3 = PWRIND-6.8U-0001: 6.8 µH Semi-Shielded Drum Core, Wirewound Inductor 3.9 A 33mOhm Max Nonstandard; Isat: 4.2A; Tolerance: 30%; Assembled?: No
Q3 = NMOS-200MA-0001: as Q1 on sheet 24V-5A-buck; Manufacturer Part Number: T2N7002AK,LM; Package: SOT-23-3
R19 = RES-200K-0001: as R48 on sheet Power-conn; MFP: ERJ-3EKF2003V; Package SIze: 0603
R20 R24 R27 = RES-10K-0002: as R7 on sheet 24V-5A-buck; Manufacturer Part Number: RC0603FR-0710KP; Package Size: 0603
R21 = RES-1K-0002: 1 kOhms ±1% 0.1W, 1/10W Chip Resistor 0603 (1608 Metric) Thin Film; Manufacturer: YAGEO; Assembled?: no; Manufacturer Part Number: RT0603FRE131KL; Package Size: 0603
R22 = RES-15K-0001: 15 kOhms ±1% 0.1W, 1/10W Chip Resistor 0402 (1005 Metric) Automotive AEC-Q200 Thick Film
R23 = RES-100K-0003: as R49 on sheet Power-conn; Package Size: 0603
R25 = RES-110K-0001: 110 kOhms ±1% 0.1W, 1/10W Chip Resistor 0603 (1608 Metric) Moisture Resistant Thick Film; Tolerance: +/- 1%; Assembled?: No; Package Size: 0603
R26 = THERM-47K-0001: as R15 on sheet 12V-5A-buck; Manufacturer Part Number: TMP6431DECR; Package Size: 0402
TP13-TP18 = TEST-POINT-0001: as TP1 on sheet 24V-5A-buck
U3 = IC-BUCK-0007: Buck Switching Regulator IC Positive Adjustable 1V 1 Output 2A 8-PowerSOIC (0.154", 3.90mm Width); Manufactuer: Texas Instruments; Assembled?: no; Manufacturer Part Number: LMR38020SDDAR; Type: Buck; Package: 8-PowerSOIC
U10 = IC-CURRENT-0004: as U9 on sheet 12V-5A-buck; Footprint: 8-SOIC

## Sheet 5V-and-3V3-ldo.SchDoc
size A; SheetNumber: 5; SheetTotal: 8
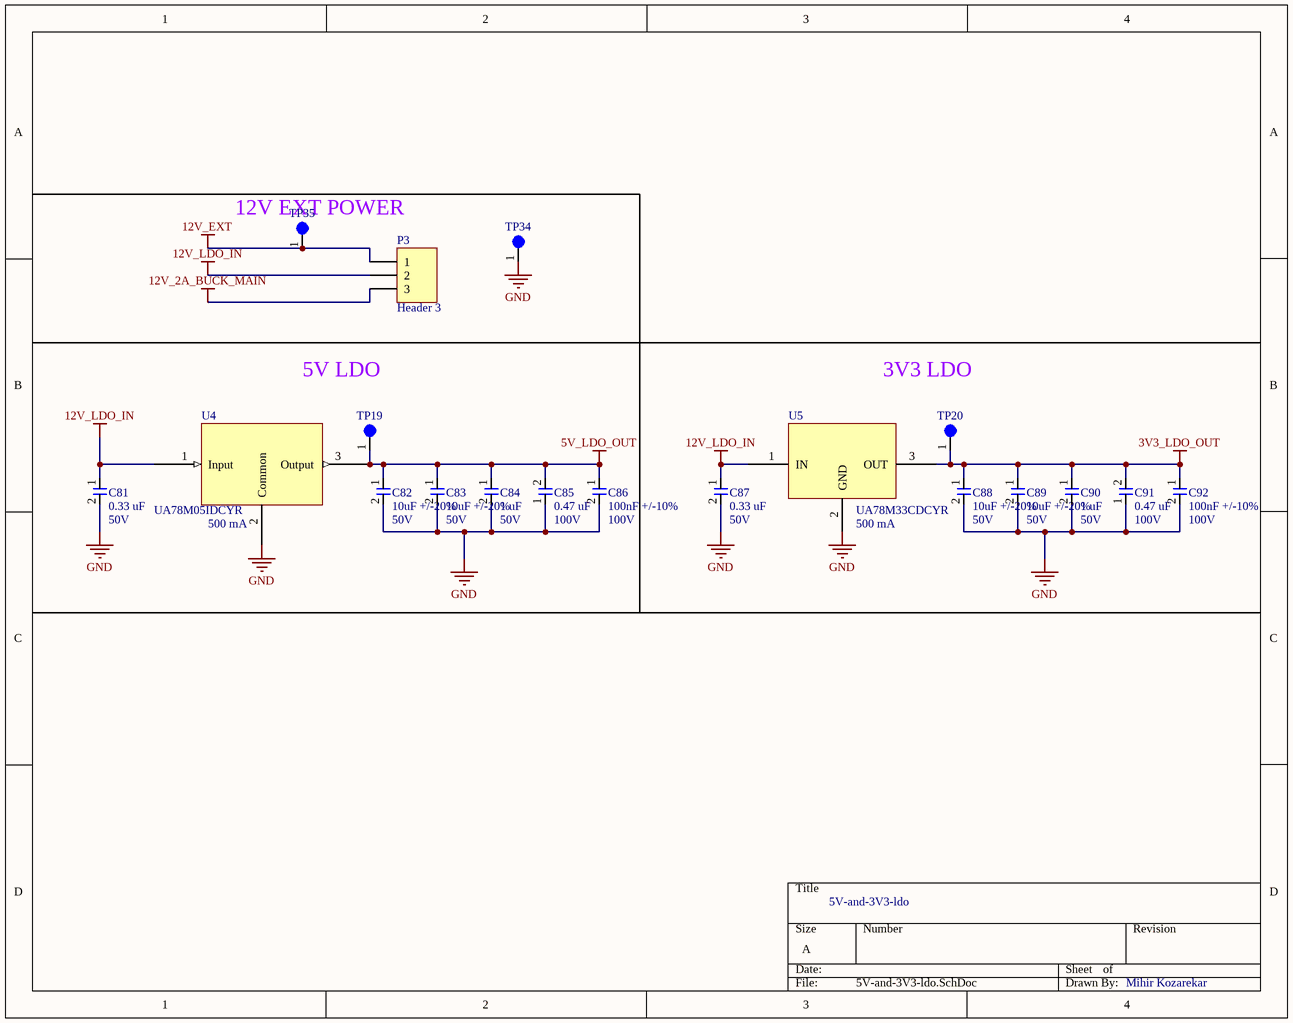
[diagram p4: 5V-and-3V3-ldo.SchDoc]

### Parts
C81  Capacitance: 0.33 uF  Voltage: 50V  [CAP-0603]  (hidden comment: CGA3E3X7R1H334K080AB)
C82  Capacitance: 10uF +/-20%  Voltage Rating: 50V  [CAP-1206]  (hidden comment: CL31B106KBHNNNE)
C83  Capacitance: 10uF +/-20%  Voltage Rating: 50V  [CAP-1206]  (hidden comment: CL31B106KBHNNNE)
C84  Capacitance: 1 uF  Voltage: 50V  [CAP-0603]  (hidden comment: UMK107AB7105KA-T)
C85  Capacitance: 0.47 uF  Voltage: 100V  [CAP-0805]  (hidden comment: KAM21KR72A474KL)
C86  Capacitance: 100nF +/-10%  Voltage Rating: 100V  [CAP-0603]  (hidden comment: CC0603KRX7R0BB104)
C87  Capacitance: 0.33 uF  Voltage: 50V  [CAP-0603]  (hidden comment: CGA3E3X7R1H334K080AB)
C88  Capacitance: 10uF +/-20%  Voltage Rating: 50V  [CAP-1206]  (hidden comment: CL31B106KBHNNNE)
C89  Capacitance: 10uF +/-20%  Voltage Rating: 50V  [CAP-1206]  (hidden comment: CL31B106KBHNNNE)
C90  Capacitance: 1 uF  Voltage: 50V  [CAP-0603]  (hidden comment: UMK107AB7105KA-T)
C91  Capacitance: 0.47 uF  Voltage: 100V  [CAP-0805]  (hidden comment: KAM21KR72A474KL)
C92  Capacitance: 100nF +/-10%  Voltage Rating: 100V  [CAP-0603]  (hidden comment: CC0603KRX7R0BB104)
P3  Header 3  [HDR1X3]
TP19  5003  [TEST-POINT-0001]  (value not drawn)
TP20  5003  [TEST-POINT-0001]  (value not drawn)
TP34  5003  [TEST-POINT-0001]  (value not drawn)
TP35  5003  [TEST-POINT-0001]  (value not drawn)
U4  UA78M05IDCYR  Current: 500 mA  [IC-SOT-223-4]
U5  UA78M33CDCYR  Current: 500 mA  [IC-SOT-223-4]

### Nets
3V3_LDO_OUT: C88.1 C89.1 C90.1 C91.2 C92.1 TP20.1 U5.3(OUT)
5V_LDO_OUT: C82.1 C83.1 C84.1 C85.2 C86.1 TP19.1 U4.3(Output)
12V_2A_BUCK_MAIN: P3.3
12V_EXT: P3.1 TP35.1
12V_LDO_IN: C81.1 C87.1 P3.2 U4.1(Input) U5.1(IN)
GND: C81.2 C82.2 C83.2 C84.2 C85.1 C86.2 C87.2 C88.2 C89.2 C90.2 C91.1 C92.2 TP34.1 U4.2(Common) U5.2(GND)

### Notes on the sheet
- (near TP35) 12V EXT POWER
- (near TP19) 5V LDO
- (near TP20) 3V3 LDO
- 5V-and-3V3-ldo
- Mihir Kozarekar

### Library data of the parts
C81 C87 = CAP-0.33uF-0001: 0.33 µF ±10% 50V Ceramic Capacitor X7R 0603 (1608 Metric); Manufacturer: TDK Corporation; Tolerance: +/- 10%; Manufacturer Part Number: CGA3E3X7R1H334K080AB; Temperature Coefficient: X7R
C82 C83 C88 C89 = CAP-10U-0001: 10 µF ±10% 50V Ceramic Capacitor X7R 1206 (3216 Metric); Manufacturer: Samsung Electro-Mechanics; Assembled?: no; Manufacturer Part Number: CL31B106KBHNNNE; Temperature Coefficient: X7R; Package Size: 1206
C84 C90 = CAP-1U-0002: as C39 on sheet 12V-5A-buck; Package Size: 0603
C85 C91 = CAP-0.47U-0001: as C13 on sheet 24V-5A-buck; Temperature Coefficient: X7R; Package Size: 0805
C86 C92 = CAP-100N-0001: as C4 on sheet 24V-5A-buck; Manufacturer Part Number: CC0603KRX7R0BB104; Temperature Coefficient: X7R; Package Size: 0603
P3 = Header 3: Header, 3-Pin; LatestRevisionDate: 17-Jul-2002; LatestRevisionNote: Re-released for DXP Platform.; Publisher: Altium Limited
TP19 TP20 TP34 TP35 = TEST-POINT-0001: as TP1 on sheet 24V-5A-buck
U4 = IC-LDO-5V-0003: Linear Voltage Regulator IC Positive Fixed 1 Output 500mA SOT-223-4; Manufacturer: Texas Instruments; Assembled?: no; Manufacturer Part Number: UA78M05IDCYR; Package Size: SOT223-4; Type: Low dropout (LDO)
U5 = IC-LDO-3.3V-0002: Linear Voltage Regulator IC Positive Fixed 1 Output 500mA SOT-223-4; Vin: 25V; Vout: 3.3V; Package: SOT-223-4

## Sheet 3V3-buck.SchDoc
size A; SheetNumber: 6; SheetTotal: 8
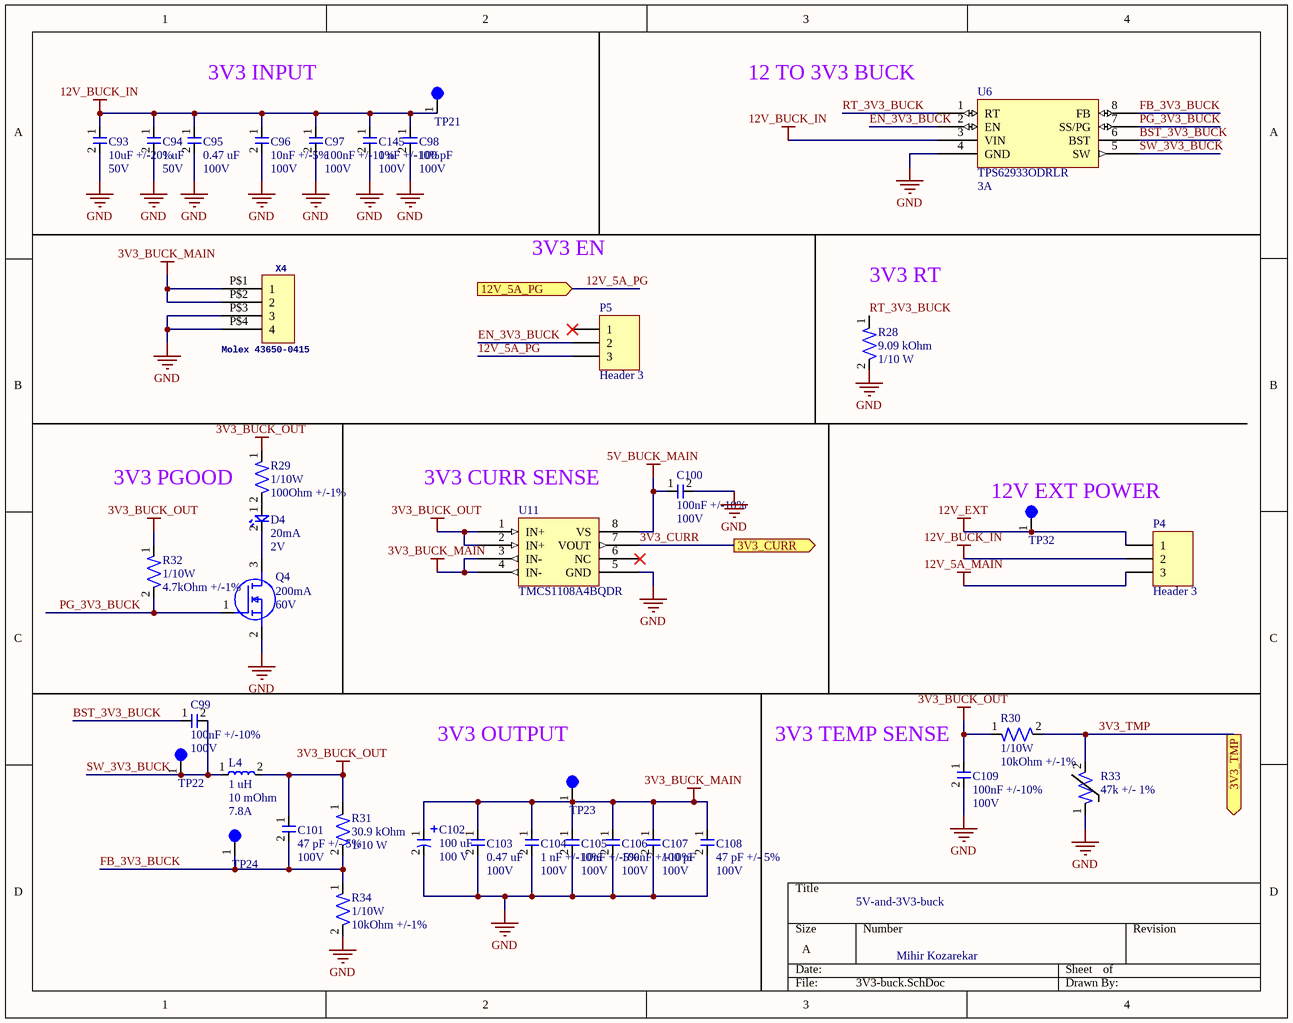
[diagram p5: 3V3-buck.SchDoc]

### Parts
C93  Capacitance: 10uF +/-20%  Voltage Rating: 50V  [CAP-1206]  (hidden comment: CL31B106KBHNNNE)
C94  Capacitance: 1 uF  Voltage: 50V  [CAP-0603]  (hidden comment: UMK107AB7105KA-T)
C95  Capacitance: 0.47 uF  Voltage: 100V  [CAP-0805]  (hidden comment: KAM21KR72A474KL)
C96  Capacitance: 10nF +/-5%  Voltage Rating: 100V  [CAP-0603]  (hidden comment: C1608C0G2A103J080AC)
C97  Capacitance: 100nF +/-10%  Voltage Rating: 100V  [CAP-0603]  (hidden comment: CC0603KRX7R0BB104)
C98  Capacitance: 100 pF  Voltage: 100V  [CAP-0603]  (hidden comment: 0603N101J101CT)
C99  Capacitance: 100nF +/-10%  Voltage Rating: 100V  [CAP-0603]  (hidden comment: CC0603KRX7R0BB104)
C100  Capacitance: 100nF +/-10%  Voltage Rating: 100V  [CAP-0603]  (hidden comment: CC0603KRX7R0BB104)
C101  Capacitance: 47 pF +/- 5%  Voltage Rating: 100V  [CAP-0603]  (hidden comment: 7447798111)
C102  Capacitance: 100 uF  Voltage: 100 V  [ELEC-100U-0001]  (hidden comment: 100SEV100M12.5X16)
C103  Capacitance: 0.47 uF  Voltage: 100V  [CAP-0805]  (hidden comment: KAM21KR72A474KL)
C104  Capacitance: 1 nF +/-10%  Voltage: 100V  [CAP-0603]  (hidden comment: C0603Y102K1RAC7867)
C105  Capacitance: 10nF +/-5%  Voltage Rating: 100V  [CAP-0603]  (hidden comment: C1608C0G2A103J080AC)
C106  Capacitance: 100nF +/-10%  Voltage Rating: 100V  [CAP-0603]  (hidden comment: CC0603KRX7R0BB104)
C107  Capacitance: 100 pF  Voltage: 100V  [CAP-0603]  (hidden comment: 0603N101J101CT)
C108  Capacitance: 47 pF +/- 5%  Voltage Rating: 100V  [CAP-0603]  (hidden comment: 7447798111)
C109  Capacitance: 100nF +/-10%  Voltage Rating: 100V  [CAP-0603]  (hidden comment: CC0603KRX7R0BB104)
C145  Capacitance: 1 nF +/-10%  Voltage: 100V  [CAP-0603]  (hidden comment: C0603Y102K1RAC7867)
D4  Current Rating: 20mA  Vf: 2V  [LED-0603]  (hidden comment: 150060AS75000)
L4  Inductance: 1 uH  DCR: 10 mOhm  DCI: 7.8A  [PWRIND-6.8U-0001]  (hidden comment: SRN8040-1R0Y)
P4  Header 3  [HDR1X3]
P5  Header 3  [HDR1X3]
Q4  Id-Continuous: 200mA  VDS-Max: 60V  [NMOS-SOT23-3]  (hidden comment: T2N7002AK,LM)
R28  Resistance: 9.09 kOhm  Power: 1/10 W  [RES-0603]  (hidden comment: RC0603FR-079K09L)
R29  Power Rating: 1/10W  Resistance: 100Ohm +/-1%  [RES-0603]  (hidden comment: AC0603FR-10100RL)
R30  Power Rating: 1/10W  Resistance: 10kOhm +/-1%  [RES-0603]  (hidden comment: RC0603FR-0710KP)
R31  Resistance: 30.9 kOhm  Power: 1/10 W  [RES-0603]  (hidden comment: RC0603FR-0730K9L)
R32  Power Rating: 1/10W  Resistance: 4.7kOhm +/-1%  [RES-0603]  (hidden comment: AF0603FR-074K7L)
R33  Resistance: 47k +/- 1%  [RES-0402]  (hidden comment: TMP6431DECR)
R34  Power Rating: 1/10W  Resistance: 10kOhm +/-1%  [RES-0603]  (hidden comment: RC0603FR-0710KP)
TP21  5003  [TEST-POINT-0001]  (value not drawn)
TP22  5003  [TEST-POINT-0001]  (value not drawn)
TP23  5003  [TEST-POINT-0001]  (value not drawn)
TP24  5003  [TEST-POINT-0001]  (value not drawn)
TP32  5003  [TEST-POINT-0001]  (value not drawn)
U6  TPS62933ODRLR  Current: 3A  [IC-SOT583]
U11  TMCS1108A4BQDR  [IC-CURRENT-0001]
X4  Molex 43650-0415  [43650-0415]

### Ports
3V3_CURR (out), 3V3_TMP (out), 12V_5A_PG (in)

### Nets
3V3_BUCK_MAIN: C102.1 C103.1 C104.1 C105.1 C106.1 C107.1 C108.1 TP23.1 U11.3(IN-) U11.4(IN-) X4.P$1(1) X4.P$2(2)
3V3_BUCK_OUT: C101.1 C109.1 L4.2 R29.1 R30.1 R31.1 R32.1 U11.1(IN+) U11.2(IN+)
5V_BUCK_MAIN: C100.1 U11.8(VS)
12V_5A_MAIN: P4.3
12V_BUCK_IN: C93.1 C94.1 C95.1 C96.1 C97.1 C98.1 C145.1 P4.2 TP21.1 U6.3(VIN)
12V_EXT: P4.1 TP32.1
GND: C93.2 C94.2 C95.2 C96.2 C97.2 C98.2 C100.2 C102.2 C103.2 C104.2 C105.2 C106.2 C107.2 C108.2 C109.2 C145.2 Q4.2(S) R28.2 R33.1 R34.2 U6.4(GND) U11.5(GND) X4.P$3(3) X4.P$4(4)
3V3_CURR: U11.7(VOUT) ; port 3V3_CURR
3V3_TMP: R30.2 R33.2 ; port 3V3_TMP
12V_5A_PG: P5.3 ; port 12V_5A_PG
BST_3V3_BUCK: C99.1 U6.6(BST)
EN_3V3_BUCK: P5.2 U6.2(EN)
FB_3V3_BUCK: C101.2 R31.2 R34.1 TP24.1 U6.8(FB)
PG_3V3_BUCK: Q4.1(G) R32.2 U6.7(SS/PG)
RT_3V3_BUCK: R28.1 U6.1(RT)
SW_3V3_BUCK: C99.2 L4.1 TP22.1 U6.5(SW)
NetD4_1: D4.1 R29.2
NetD4_2: D4.2 Q4.3(D)

Not connected (* = marked no-connect by the designer): P5 1*; U11 6(NC)*

### Notes on the sheet
- 3V3 INPUT
- 12 TO 3V3 BUCK
- 3V3 EN
- (near R28) 3V3 RT
- 3V3 PGOOD
- (near U11) 3V3 CURR SENSE
- (near TP32) 12V EXT POWER
- (near TP23) 3V3 OUTPUT
- (near C109) 3V3 TEMP SENSE
- 5V-and-3V3-buck
- Mihir Kozarekar

### Library data of the parts
C93 = CAP-10U-0001: as C82 on sheet 5V-and-3V3-ldo; Manufacturer Part Number: CL31B106KBHNNNE; Temperature Coefficient: X7R; Package Size: 1206
C94 = CAP-1U-0002: as C39 on sheet 12V-5A-buck; Package Size: 0603
C95 C103 = CAP-0.47U-0001: as C13 on sheet 24V-5A-buck; Temperature Coefficient: X7R; Package Size: 0805
C96 C105 = CAP-10N-0002: as C5 on sheet 24V-5A-buck; Manufacturer Part Number: C1608C0G2A103J080AC; Package Size: 0603
C97 C99 C100 C106 C109 = CAP-100N-0001: as C4 on sheet 24V-5A-buck; Manufacturer Part Number: CC0603KRX7R0BB104; Temperature Coefficient: X7R; Package Size: 0603
C98 C107 = CAP-100P-0002: as C7 on sheet 24V-5A-buck; Package Size: 0603
C101 C108 = CAP-47P-0001: as C64 on sheet 12V-2A-buck
C102 = ELEC-100U-0001: as C1 on sheet 24V-5A-buck
C104 C145 = CAP-1N-0001: as C6 on sheet 24V-5A-buck
D4 = LED_Amber_0001: as D1 on sheet 24V-5A-buck; Manufacturer Part Number: 150060AS75000; Package Size: 0603
L4 = PWRIND-1U-0001: 1 µH Semi-Shielded Drum Core, Wirewound Inductor 7.8 A 10mOhm Max Nonstandard; Isat: 11A; Tolerance: 30%; Assembled?: No
P4 P5 = Header 3: Header, 3-Pin; LatestRevisionDate: 17-Jul-2002; LatestRevisionNote: Re-released for DXP Platform.; Publisher: Altium Limited
Q4 = NMOS-200MA-0001: as Q1 on sheet 24V-5A-buck; Manufacturer Part Number: T2N7002AK,LM; Package: SOT-23-3
R28 = RES-9.09K-0001: as R18 on sheet 12V-5A-buck; Package Size: 0603
R29 = RES-100-0002: as R6 on sheet 24V-5A-buck; Manufacturer Part Number: AC0603FR-10100RL; Package Size: 0603
R30 R34 = RES-10K-0002: as R7 on sheet 24V-5A-buck; Manufacturer Part Number: RC0603FR-0710KP; Package Size: 0603
R31 = RES-30.9K-0001: 30.9 kOhms ±1% 0.1W, 1/10W Chip Resistor 0603 (1608 Metric) Moisture Resistant Thick Film; Assembled?: No; Tolerance: 1%; Package Size: 0603
R32 = RES-4.7K-0002: RES SMD 4.7K OHM 1% 1/10W 0603; Manufacturer: YAGEO; Assembled?: no; Manufacturer Part Number: AF0603FR-074K7L; Package Size: 0603
R33 = THERM-47K-0001: as R15 on sheet 12V-5A-buck; Manufacturer Part Number: TMP6431DECR; Package Size: 0402
TP21-TP24 TP32 = TEST-POINT-0001: as TP1 on sheet 24V-5A-buck
U6 = IC-BUCK-0010: Buck Switching Regulator IC Positive Adjustable 0.8V 1 Output 3A SOT-583; Manufacturer: Texas Instruments; Assembled?: no; Manufacturer Part Number: TPS62933ODRLR; Type: Buck
U11 = IC-CURRENT-0004: as U9 on sheet 12V-5A-buck; Footprint: 8-SOIC
X4 = Micro-Fit Molex 4 Pin Vertical: as X2 on sheet 24V-5A-buck; DeviceName: 43650-0415; LibraryName: con-molex-micro-fit-3_0_2; Package: 43650-0415

## Sheet 5V-buck.SchDoc
size A; SheetNumber: 7; SheetTotal: 8
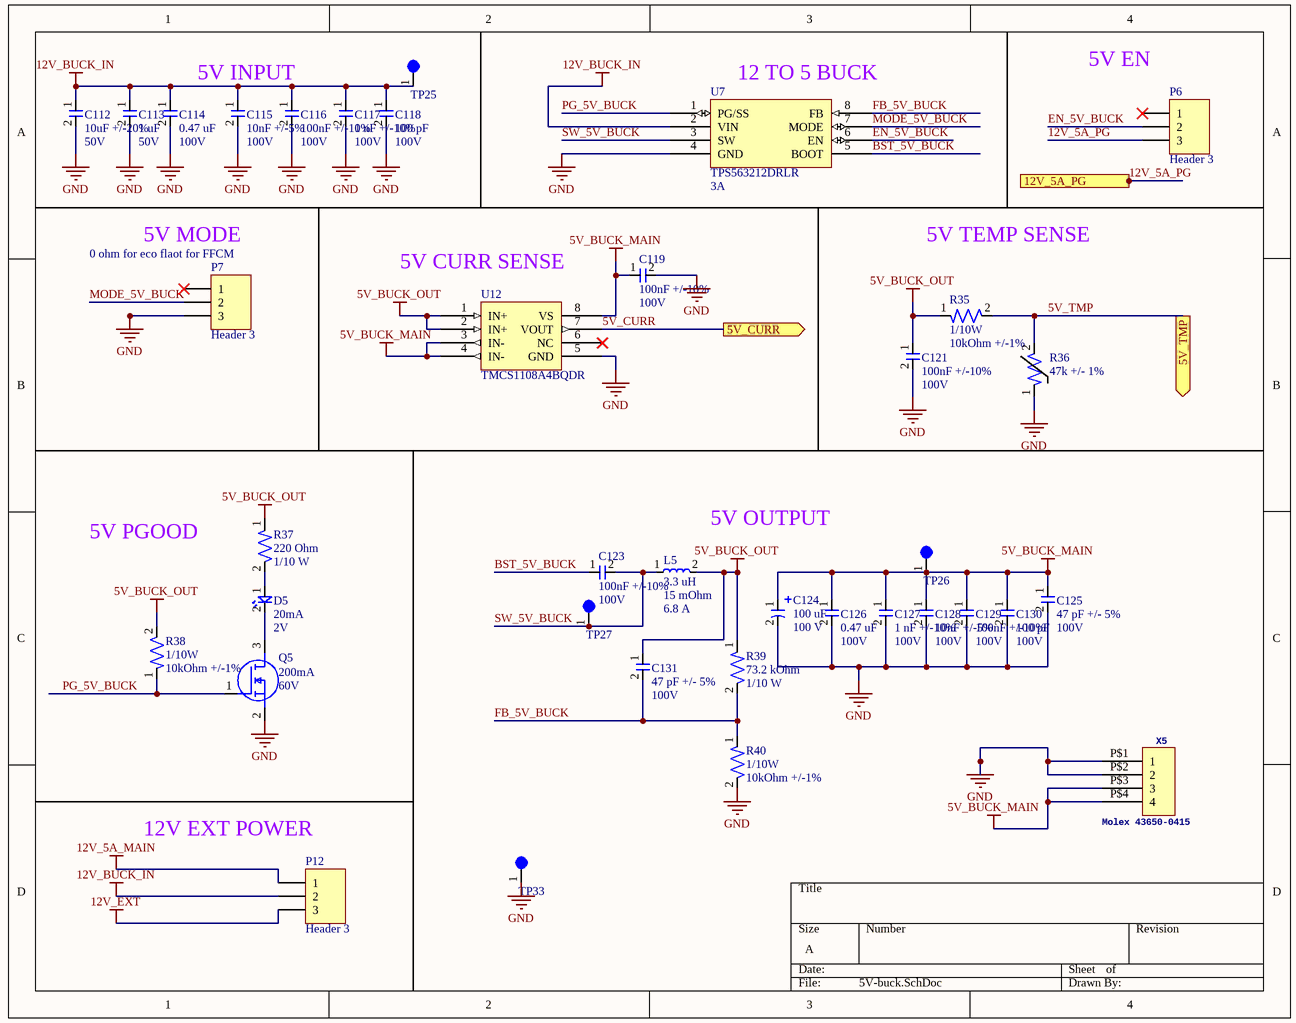
[diagram p6: 5V-buck.SchDoc]

### Parts
C112  Capacitance: 10uF +/-20%  Voltage Rating: 50V  [CAP-1206]  (hidden comment: CL31B106KBHNNNE)
C113  Capacitance: 1 uF  Voltage: 50V  [CAP-0603]  (hidden comment: UMK107AB7105KA-T)
C114  Capacitance: 0.47 uF  Voltage: 100V  [CAP-0805]  (hidden comment: KAM21KR72A474KL)
C115  Capacitance: 10nF +/-5%  Voltage Rating: 100V  [CAP-0603]  (hidden comment: C1608C0G2A103J080AC)
C116  Capacitance: 100nF +/-10%  Voltage Rating: 100V  [CAP-0603]  (hidden comment: CC0603KRX7R0BB104)
C117  Capacitance: 1 nF +/-10%  Voltage: 100V  [CAP-0603]  (hidden comment: C0603Y102K1RAC7867)
C118  Capacitance: 100 pF  Voltage: 100V  [CAP-0603]  (hidden comment: 0603N101J101CT)
C119  Capacitance: 100nF +/-10%  Voltage Rating: 100V  [CAP-0603]  (hidden comment: CC0603KRX7R0BB104)
C121  Capacitance: 100nF +/-10%  Voltage Rating: 100V  [CAP-0603]  (hidden comment: CC0603KRX7R0BB104)
C123  Capacitance: 100nF +/-10%  Voltage Rating: 100V  [CAP-0603]  (hidden comment: CC0603KRX7R0BB104)
C124  Capacitance: 100 uF  Voltage: 100 V  [ELEC-100U-0001]  (hidden comment: 100SEV100M12.5X16)
C125  Capacitance: 47 pF +/- 5%  Voltage Rating: 100V  [CAP-0603]  (hidden comment: 7447798111)
C126  Capacitance: 0.47 uF  Voltage: 100V  [CAP-0805]  (hidden comment: KAM21KR72A474KL)
C127  Capacitance: 1 nF +/-10%  Voltage: 100V  [CAP-0603]  (hidden comment: C0603Y102K1RAC7867)
C128  Capacitance: 10nF +/-5%  Voltage Rating: 100V  [CAP-0603]  (hidden comment: C1608C0G2A103J080AC)
C129  Capacitance: 100nF +/-10%  Voltage Rating: 100V  [CAP-0603]  (hidden comment: CC0603KRX7R0BB104)
C130  Capacitance: 100 pF  Voltage: 100V  [CAP-0603]  (hidden comment: 0603N101J101CT)
C131  Capacitance: 47 pF +/- 5%  Voltage Rating: 100V  [CAP-0603]  (hidden comment: 7447798111)
D5  Current Rating: 20mA  Vf: 2V  [LED-0603]  (hidden comment: 150060AS75000)
L5  Inductance: 3.3 uH  DCR: 15 mOhm  DCI: 6.8 A  [PWRIND-3.3U-0003]  (hidden comment: SRR1240-3R3Y)
P6  Header 3  [HDR1X3]
P7  Header 3  [HDR1X3]
P12  Header 3  [HDR1X3]
Q5  Id-Continuous: 200mA  VDS-Max: 60V  [NMOS-SOT23-3]  (hidden comment: T2N7002AK,LM)
R35  Power Rating: 1/10W  Resistance: 10kOhm +/-1%  [RES-0603]  (hidden comment: RC0603FR-0710KP)
R36  Resistance: 47k +/- 1%  [RES-0402]  (hidden comment: TMP6431DECR)
R37  Resistance: 220 Ohm  Power: 1/10 W  [RES-0603]  (hidden comment: CRGCQ0603J220R)
R38  Power Rating: 1/10W  Resistance: 10kOhm +/-1%  [RES-0603]  (hidden comment: RC0603FR-0710KP)
R39  Resistance: 73.2 kOhm  Power: 1/10 W  [RES-0603]  (hidden comment: RC0603FR-0773K2L)
R40  Power Rating: 1/10W  Resistance: 10kOhm +/-1%  [RES-0603]  (hidden comment: RC0603FR-0710KP)
TP25  5003  [TEST-POINT-0001]  (value not drawn)
TP26  5003  [TEST-POINT-0001]  (value not drawn)
TP27  5003  [TEST-POINT-0001]  (value not drawn)
TP33  5003  [TEST-POINT-0001]  (value not drawn)
U7  TPS563212DRLR  Current: 3A  [IC-SOT583]
U12  TMCS1108A4BQDR  [IC-CURRENT-0001]
X5  Molex 43650-0415  [43650-0415]

### Ports
5V_CURR (out), 5V_TMP (out), 12V_5A_PG (in)

### Nets
5V_BUCK_MAIN: C119.1 C124.1 C125.1 C126.1 C127.1 C128.1 C129.1 C130.1 TP26.1 U12.3(IN-) U12.4(IN-) U12.8(VS) X5.P$3(3) X5.P$4(4)
5V_BUCK_OUT: C121.1 C131.1 L5.2 R35.1 R37.1 R38.2 R39.1 U12.1(IN+) U12.2(IN+)
12V_5A_MAIN: P12.1
12V_BUCK_IN: C112.1 C113.1 C114.1 C115.1 C116.1 C117.1 C118.1 P12.2 TP25.1 U7.2(VIN)
12V_EXT: P12.3
GND: C112.2 C113.2 C114.2 C115.2 C116.2 C117.2 C118.2 C119.2 C121.2 C124.2 C125.2 C126.2 C127.2 C128.2 C129.2 C130.2 P7.3 Q5.2(S) R36.1 R40.2 TP33.1 U7.4(GND) U12.5(GND) X5.P$1(1) X5.P$2(2)
5V_CURR: U12.7(VOUT) ; port 5V_CURR
5V_TMP: R35.2 R36.2 ; port 5V_TMP
12V_5A_PG: P6.3 ; port 12V_5A_PG
BST_5V_BUCK: C123.1 U7.5(BOOT)
EN_5V_BUCK: P6.2 U7.6(EN)
FB_5V_BUCK: C131.2 R39.2 R40.1 U7.8(FB)
MODE_5V_BUCK: P7.2 U7.7(MODE)
PG_5V_BUCK: Q5.1(G) R38.1 U7.1(PG/SS)
SW_5V_BUCK: C123.2 L5.1 TP27.1 U7.3(SW)
NetD5_1: D5.1 R37.2
NetD5_2: D5.2 Q5.3(D)

Not connected (* = marked no-connect by the designer): P6 1*; P7 1*; U12 6(NC)*

### Notes on the sheet
- 5V INPUT
- (near U7) 12 TO 5 BUCK
- (near P6) 5V EN
- (near P7) 0 ohm for eco flaot for FFCM
- (near P7) 5V MODE
- (near U12) 5V CURR SENSE
- 5V TEMP SENSE
- 5V PGOOD
- (near L5) 5V OUTPUT
- (near P12) 12V EXT POWER

### Library data of the parts
C112 = CAP-10U-0001: as C82 on sheet 5V-and-3V3-ldo; Manufacturer Part Number: CL31B106KBHNNNE; Temperature Coefficient: X7R; Package Size: 1206
C113 = CAP-1U-0002: as C39 on sheet 12V-5A-buck; Package Size: 0603
C114 C126 = CAP-0.47U-0001: as C13 on sheet 24V-5A-buck; Temperature Coefficient: X7R; Package Size: 0805
C115 C128 = CAP-10N-0002: as C5 on sheet 24V-5A-buck; Manufacturer Part Number: C1608C0G2A103J080AC; Package Size: 0603
C116 C119 C121 C123 C129 = CAP-100N-0001: as C4 on sheet 24V-5A-buck; Manufacturer Part Number: CC0603KRX7R0BB104; Temperature Coefficient: X7R; Package Size: 0603
C117 C127 = CAP-1N-0001: as C6 on sheet 24V-5A-buck
C118 C130 = CAP-100P-0002: as C7 on sheet 24V-5A-buck; Package Size: 0603
C124 = ELEC-100U-0001: as C1 on sheet 24V-5A-buck
C125 C131 = CAP-47P-0001: as C64 on sheet 12V-2A-buck
D5 = LED_Amber_0001: as D1 on sheet 24V-5A-buck; Manufacturer Part Number: 150060AS75000; Package Size: 0603
L5 = PWRIND-3.3U-0003: 3.3 µH Shielded Drum Core, Wirewound Inductor 6.8 A 15mOhm Max Nonstandard; Isat: 6.5A; Tolerance: 30%; Assembled?: No
P6 P7 P12 = Header 3: Header, 3-Pin; LatestRevisionDate: 17-Jul-2002; LatestRevisionNote: Re-released for DXP Platform.; Publisher: Altium Limited
Q5 = NMOS-200MA-0001: as Q1 on sheet 24V-5A-buck; Manufacturer Part Number: T2N7002AK,LM; Package: SOT-23-3
R35 R38 R40 = RES-10K-0002: as R7 on sheet 24V-5A-buck; Manufacturer Part Number: RC0603FR-0710KP; Package Size: 0603
R36 = THERM-47K-0001: as R15 on sheet 12V-5A-buck; Manufacturer Part Number: TMP6431DECR; Package Size: 0402
R37 = RES-220-003: 220 Ohms ±5% 0.1W, 1/10W Chip Resistor 0603 (1608 Metric) Automotive AEC-Q200, Moisture Resistant Thick Film; Tolerance: +/- 5%; Package Size: 0603
R39 = RES-73.2K-0001: 73.2 kOhms ±1% 0.1W, 1/10W Chip Resistor 0603 (1608 Metric) Moisture Resistant Thick Film; Assembled?: No; Tolerance: 1%; Package Size: 0603
TP25-TP27 TP33 = TEST-POINT-0001: as TP1 on sheet 24V-5A-buck
U7 = IC-BUCK-0008: Buck Switching Regulator IC Positive Adjustable 0.6V 1 Output 3A SOT-583; Manufacturer: Texaas Instruments; Assembled?: no; Manufacturer Part Number: TPS563212DRLR; Type: Buck; Package Size: SOT-583
U12 = IC-CURRENT-0004: as U9 on sheet 12V-5A-buck; Footprint: 8-SOIC
X5 = Micro-Fit Molex 4 Pin Vertical: as X2 on sheet 24V-5A-buck; DeviceName: 43650-0415; LibraryName: con-molex-micro-fit-3_0_2; Package: 43650-0415